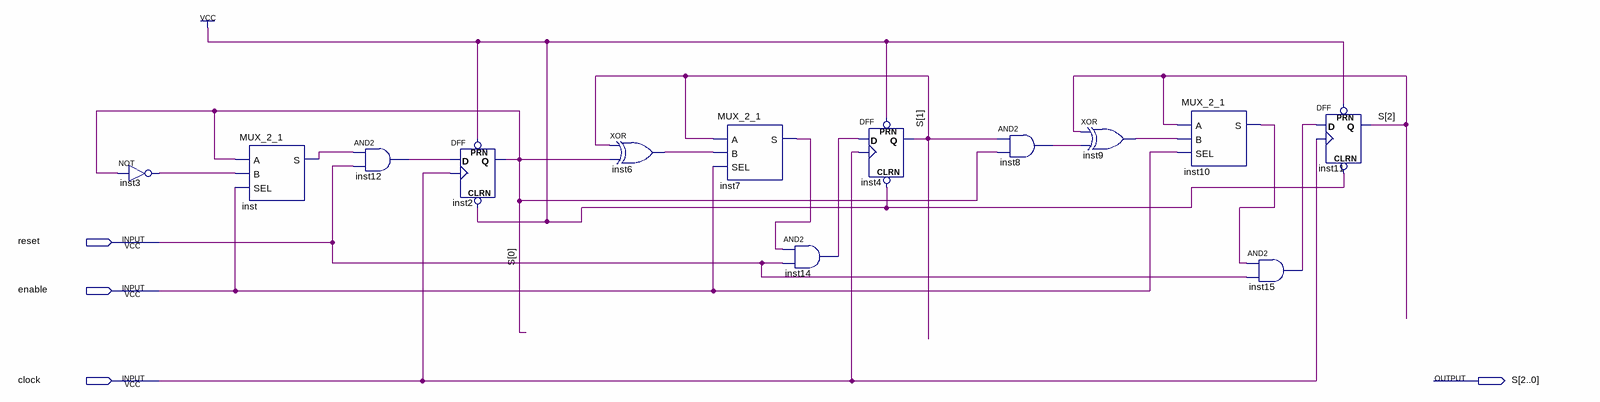
[diagram p0: schematic sheet]
// Quartus schematic contador3bits.bdf as structural Verilog: 13 symbols, 4 pins
module contador3bits (
  input  reset,
  input  enable,
  input  clock,
  output [2:0] S
);

  wire inst3_out, inst6_out, inst7_s, inst8_out, inst9_out, inst10_s, inst12_out, inst14_out, inst15_out,
       inst_s;

  not inst3 (inst3_out, S[0]);
  MUX_2_1 inst (.A(S[0]), .B(inst3_out), .SEL(enable), .S(inst_s));
  and inst12 (inst12_out, inst_s, reset);
  DFF inst2 (.CLRN(1'b1), .CLK(clock), .D(inst12_out), .PRN(1'b1), .Q(S[0]));
  xor inst6 (inst6_out, S[1], S[0]);
  MUX_2_1 inst7 (.A(S[1]), .B(inst6_out), .SEL(enable), .S(inst7_s));
  and inst14 (inst14_out, inst7_s, reset);
  DFF inst4 (.CLRN(1'b1), .CLK(clock), .D(inst14_out), .PRN(1'b1), .Q(S[1]));
  and inst8 (inst8_out, S[1], S[0]);
  xor inst9 (inst9_out, S[2], inst8_out);
  MUX_2_1 inst10 (.A(S[2]), .B(inst9_out), .SEL(enable), .S(inst10_s));
  and inst15 (inst15_out, inst10_s, reset);
  DFF inst11 (.CLRN(1'b1), .CLK(clock), .D(inst15_out), .PRN(1'b1), .Q(S[2]));
endmodule
